# Altium schematic sheet devices.SchDoc
size A3
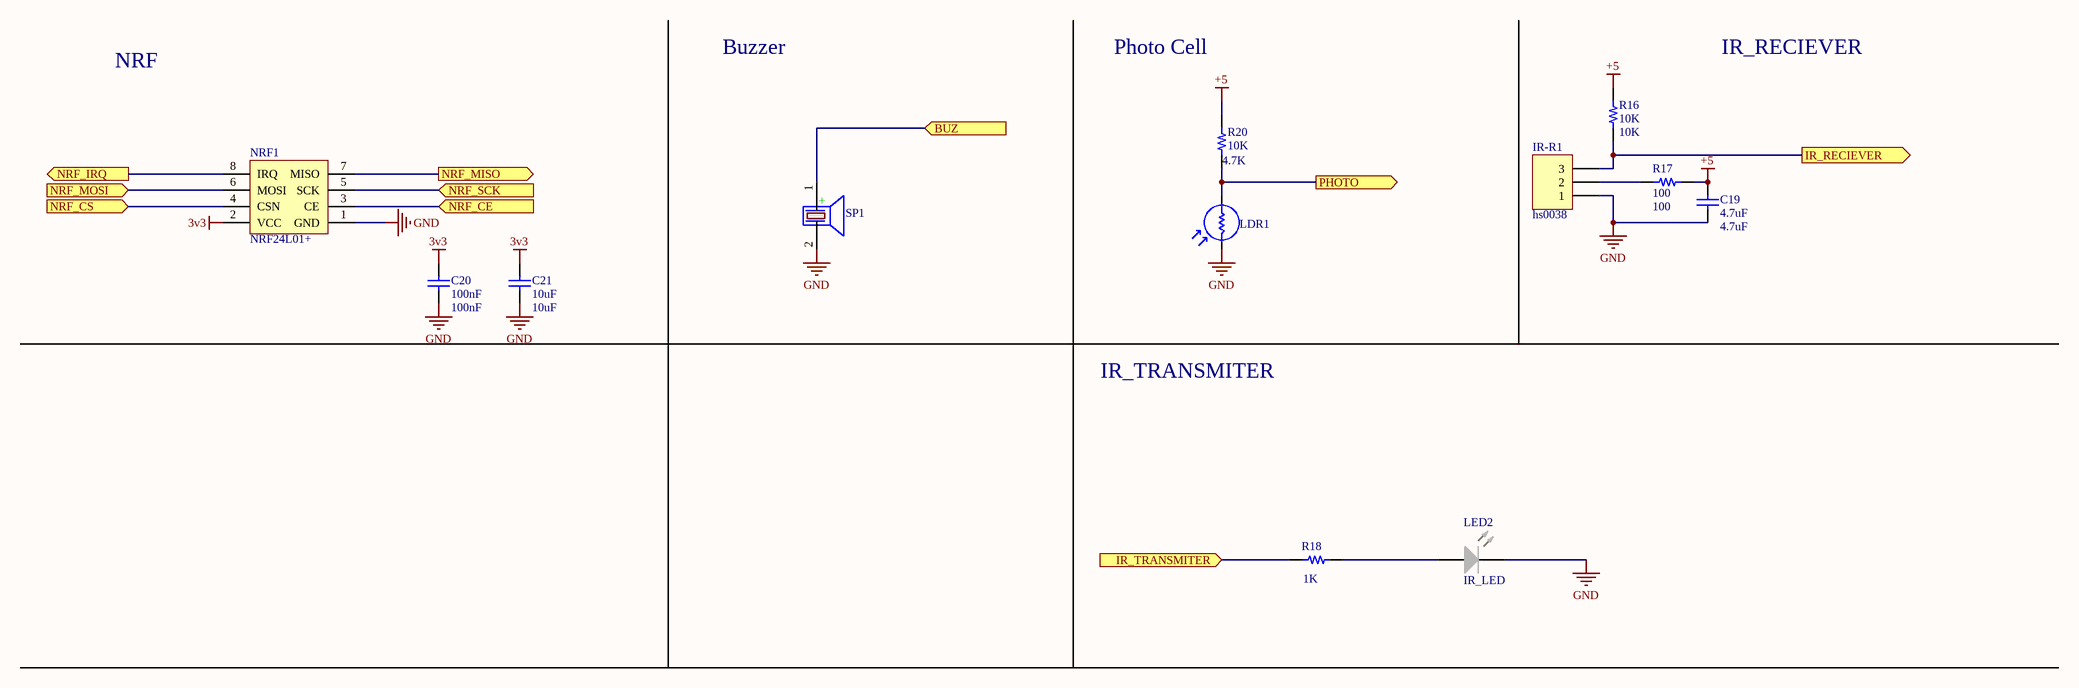
[diagram p0: devices.SchDoc]

## Parts
C19  4.7uF  [0603C]
C20  100nF  [0603C]
C21  10uF  [0603C]
IR-R1  hs0038  [HS3800B]
LDR1  PhotoCell-5mm  [PhotoCell]  (value not drawn)
LED2  IR_LED  [LED_WHITE]
NRF1  NRF24L01+  [NRF24L01P]
R16  10K  [0603R]
R17  100  [0603R]
R18  1K  [0603R]
R20  10K  value 4.7K  [0603R]
SP1  BUZZER  [BUZZER 7.62mm DC]  (value not drawn)

## Ports
BUZ (in), IR_RECIEVER (out), IR_TRANSMITER (in), NRF_CE (in), NRF_CS (in), NRF_IRQ (out), NRF_MISO (out), NRF_MOSI (in), NRF_SCK (in), PHOTO (out)

## Nets
3v3: C20.2 C21.2 NRF1.2(VCC)
+5: C19.2 R16.1 R17.1 R20.1
GND: C19.1 C20.1 C21.1 IR-R1.1 LDR1.1 LED2.K NRF1.1(GND) SP1.2(-)
BUZ: SP1.1(+) ; port BUZ
IR_RECIEVER: IR-R1.3 R16.2 ; port IR_RECIEVER
IR_TRANSMITER: R18.2 ; port IR_TRANSMITER
NRF_CE: NRF1.3(CE) ; port NRF_CE
NRF_CS: NRF1.4(CSN) ; port NRF_CS
NRF_IRQ: NRF1.8(IRQ) ; port NRF_IRQ
NRF_MISO: NRF1.7(MISO) ; port NRF_MISO
NRF_MOSI: NRF1.6(MOSI) ; port NRF_MOSI
NRF_SCK: NRF1.5(SCK) ; port NRF_SCK
PHOTO: LDR1.2 R20.2 ; port PHOTO
NetIR-R1_2: IR-R1.2 R17.2
NetLED2_A: LED2.A R18.1

## Notes on the sheet
- NRF
- Buzzer
- Photo Cell
- IR_RECIEVER
- IR_TRANSMITER

## Library data of the parts
C19-C21 = Cap: CAP SMD 0603; Published: 8-Jun-2000; LatestRevisionDate: 17-Jul-2002; LatestRevisionNote: Re-released for DXP Platform.; PackageReference: RAD-0.3; Publisher: Altium Limited; PackageDescription: Radial Cap, Thru-Hole; 2 Leads; 0.3 in Pin Spacing
  C19: Value: 4.7uF
  C20: Value: 100nF
  C21: Value: 10uF
IR-R1 = Header 3H: Header, 3-Pin, Right Angle; LatestRevisionDate: 17-Jul-2002; LatestRevisionNote: Re-released for DXP Platform.; Publisher: Altium Limited
LDR1 = LDR: Photo Cell- Variable Resistor With Light; Company: IPA CO.; Designer: Saeid Jorablo; Last Update Time: 2008/07/17
LED2 = LED-W
NRF1 = NRF24L01P: NRF Module; Ali Hafizi: Creature
R16-R18 R20 = Resistor: RES SMD 0603; Part Number: RCS0805100KFKEA
  R16: Value: 10K
  R17: Value: 100
  R18: Value: 1K
SP1 = PIEZO BUZZER: PIEZO BUZZER 5VOLTS; Designer: Abbas Basereh; Comment_1: SPEAKER AND BEEP; Design Date: 1395/11/14; ComponentLink2Description: Reference; PackageDescription: THD; Publisher: Abbas Basereh; Mounting Technology: THD; Pin Count: 2; Status: Unreleased